# EAGLE schematic THEBIGONE (EAGLE 6.4)
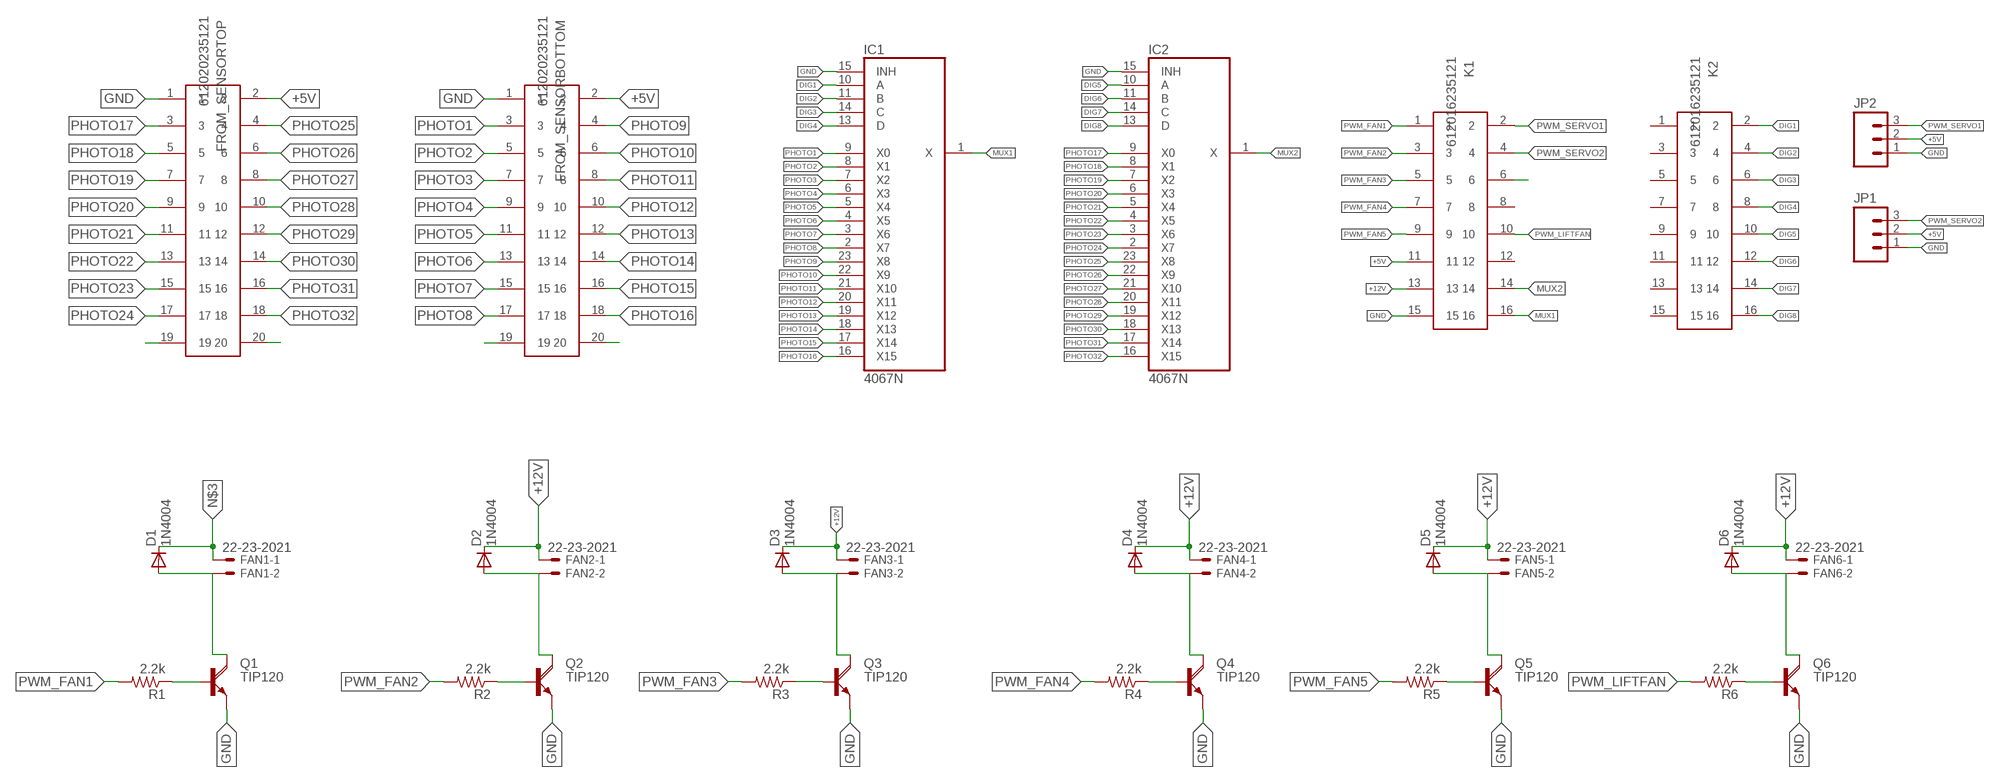
[diagram p0: schematic, sheet 1]

## Parts
D1  1N4004  [DO41-10]
D2  1N4004  [DO41-10]
D3  1N4004  [DO41-10]
D4  1N4004  [DO41-10]
D5  1N4004  [DO41-10]
D6  1N4004  [DO41-10]
FAN1  22-23-2021  [22-23-2021]
FAN2  22-23-2021  [22-23-2021]
FAN3  22-23-2021  [22-23-2021]
FAN4  22-23-2021  [22-23-2021]
FAN5  22-23-2021  [22-23-2021]
FAN6  22-23-2021  [22-23-2021]
FROM_SENSORBOTTOM  612020235121  [612020235121]
FROM_SENSORTOP  612020235121  [612020235121]
IC1  4067N  [DIL24-6]
IC2  4067N  [DIL24-6]
JP1  M03JST-PTH-VERT  [JST-3-PTH-VERT]
JP2  M03JST-PTH-VERT  [JST-3-PTH-VERT]
K1  612016235121  [612016235121]
K2  612016235121  [612016235121]
Q1  TIP120  [TO220AH]
Q2  TIP120  [TO220AH]
Q3  TIP120  [TO220AH]
Q4  TIP120  [TO220AH]
Q5  TIP120  [TO220AH]
Q6  TIP120  [TO220AH]
R1  2.2k  R-US_0204/7  [0204/7]
R2  2.2k  R-US_0204/7  [0204/7]
R3  2.2k  R-US_0204/7  [0204/7]
R4  2.2k  R-US_0204/7  [0204/7]
R5  2.2k  R-US_0204/7  [0204/7]
R6  2.2k  R-US_0204/7  [0204/7]

## Nets
+5V: FROM_SENSORBOTTOM.2 FROM_SENSORTOP.2 JP1.2 JP2.2 K1.11
+12V: D1.C D2.C D3.C FAN1.1 FAN2.1 FAN3.1 K1.13
DIG1: IC1.10(A) K2.2
DIG2: IC1.11(B) K2.4
DIG3: IC1.14(C) K2.6
DIG4: IC1.13(D) K2.8
DIG5: IC2.10(A) K2.10
DIG6: IC2.11(B) K2.12
DIG7: IC2.14(C) K2.14
DIG8: IC2.13(D) K2.16
GND: FROM_SENSORBOTTOM.1 FROM_SENSORTOP.1 IC1.15(INH) IC2.15(INH) JP1.1 JP2.1 K1.15 Q1.E Q2.E Q3.E Q4.E Q5.E Q6.E
MUX1: IC1.1(X) K1.16
MUX2: IC2.1(X) K1.14
N$1: D1.A FAN1.2 Q1.C
N$2: D2.A FAN2.2 Q2.C
N$4: Q1.B R1.1
N$5: Q2.B R2.1
N$6: D3.A FAN3.2 Q3.C
N$7: D4.A FAN4.2 Q4.C
N$8: D4.C FAN4.1
N$9: Q5.B R5.1
N$10: Q4.B R4.1
N$11: D5.A FAN5.2 Q5.C
N$12: D5.C FAN5.1
N$13: Q3.B R3.1
N$16: Q6.B R6.1
N$17: D6.A FAN6.2 Q6.C
N$18: D6.C FAN6.1
N$19: FROM_SENSORTOP.19
N$20: FROM_SENSORTOP.20
N$26: FROM_SENSORBOTTOM.19
N$27: FROM_SENSORBOTTOM.20
PHOTO1: FROM_SENSORBOTTOM.3 IC1.9(X0)
PHOTO2: FROM_SENSORBOTTOM.5 IC1.8(X1)
PHOTO3: FROM_SENSORBOTTOM.7 IC1.7(X2)
PHOTO4: FROM_SENSORBOTTOM.9 IC1.6(X3)
PHOTO5: FROM_SENSORBOTTOM.11 IC1.5(X4)
PHOTO6: FROM_SENSORBOTTOM.13 IC1.4(X5)
PHOTO7: FROM_SENSORBOTTOM.15 IC1.3(X6)
PHOTO8: FROM_SENSORBOTTOM.17 IC1.2(X7)
PHOTO9: FROM_SENSORBOTTOM.4 IC1.23(X8)
PHOTO10: FROM_SENSORBOTTOM.6 IC1.22(X9)
PHOTO11: FROM_SENSORBOTTOM.8 IC1.21(X10)
PHOTO12: FROM_SENSORBOTTOM.10 IC1.20(X11)
PHOTO13: FROM_SENSORBOTTOM.12 IC1.19(X12)
PHOTO14: FROM_SENSORBOTTOM.14 IC1.18(X13)
PHOTO15: FROM_SENSORBOTTOM.16 IC1.17(X14)
PHOTO16: FROM_SENSORBOTTOM.18 IC1.16(X15)
PHOTO17: FROM_SENSORTOP.3 IC2.9(X0)
PHOTO18: FROM_SENSORTOP.5 IC2.8(X1)
PHOTO19: FROM_SENSORTOP.7 IC2.7(X2)
PHOTO20: FROM_SENSORTOP.9 IC2.6(X3)
PHOTO21: FROM_SENSORTOP.11 IC2.5(X4)
PHOTO22: FROM_SENSORTOP.13 IC2.4(X5)
PHOTO23: FROM_SENSORTOP.15 IC2.3(X6)
PHOTO24: FROM_SENSORTOP.17 IC2.2(X7)
PHOTO25: FROM_SENSORTOP.4 IC2.23(X8)
PHOTO26: FROM_SENSORTOP.6 IC2.22(X9)
PHOTO27: FROM_SENSORTOP.8 IC2.21(X10)
PHOTO28: FROM_SENSORTOP.10 IC2.20(X11)
PHOTO29: FROM_SENSORTOP.12 IC2.19(X12)
PHOTO30: FROM_SENSORTOP.14 IC2.18(X13)
PHOTO31: FROM_SENSORTOP.16 IC2.17(X14)
PHOTO32: FROM_SENSORTOP.18 IC2.16(X15)
PWM_FAN1: K1.1 R1.2
PWM_FAN2: K1.3 R2.2
PWM_FAN3: K1.5 R3.2
PWM_FAN4: K1.7 R4.2
PWM_FAN5: K1.9 R5.2
PWM_LIFTFAN: K1.10 R6.2
PWM_SERVO1: JP2.3 K1.2
PWM_SERVO2: JP1.3 K1.4
PWM_SERVO3: K1.6
Unconnected: K1.8 K1.12 K2.1 K2.3 K2.5 K2.7 K2.9 K2.11 K2.13 K2.15

## Power pins joined to a net without a drawn wire
VDD: IC1.24(VDD) IC2.24(VDD)
VSS: IC1.12(VSS) IC2.12(VSS)

## Library data of the parts
D1-D6 = diode:1N4004: DIODE general purpose rectifier, 1 A
FAN1-FAN6 = con-molex:22-23-2021: .100" (2.54mm) Center Header - 2 Pin; MF: MOLEX; MPN: 22-23-2021; OC_FARNELL: 1462926; OC_NEWARK: 25C3832
FROM_SENSORBOTTOM FROM_SENSORTOP = Wuerth_Elektronik_eiCan_05_Box_Header_IDC_Connectors_1_2:612020235121: WR-BHD 2.54mm Male Box Header High Temperature, 20 Pins
IC1 IC2 = 40xx:4067: 16-channel ANALOG MULTIPLEXER
JP1 JP2 = SparkFun-Connectors:M03: Header 3 Standard 3-pin 0.1" header. Use with straight break away headers (SKU : PRT-00116), right angle break away headers (PRT-00553), swiss pins (PRT-00743), machine pins (PRT-00117), and female headers (PRT-00115). Molex polarized connector foot print use with SKU : PRT-08232 with associated crimp pins and housings.
K1 K2 = Wuerth_Elektronik_eiCan_05_Box_Header_IDC_Connectors_1_2:612016235121: WR-BHD 2.54mm Male Box Header High Temperature, 16 Pins
Q1-Q6 = transistor-power:TIP120: NPN DARLINGTON TRANSISTOR
R1-R6 = rcl:R-US_: RESISTOR, American symbol